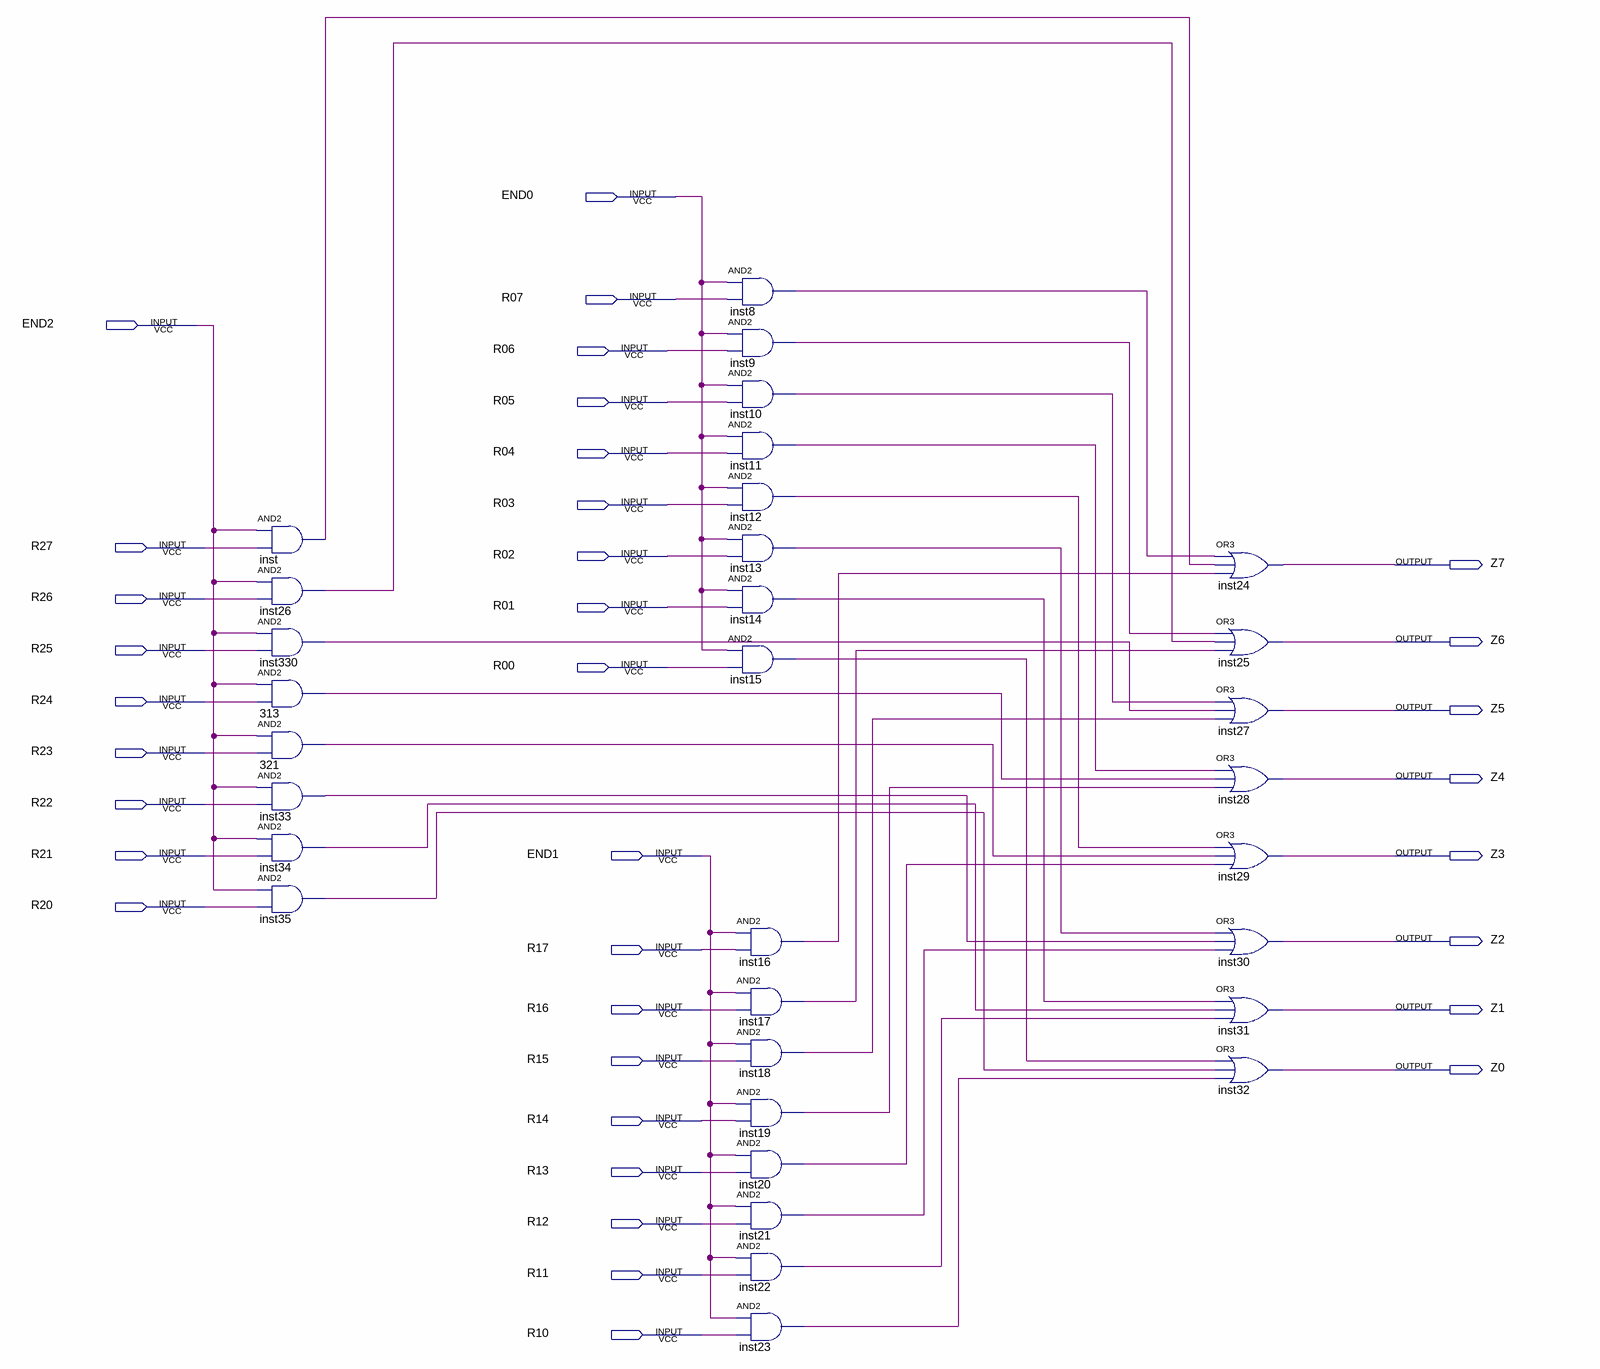
[diagram p0: schematic sheet]
// Quartus schematic select.bdf as structural Verilog: 32 symbols, 35 pins
module select (
  input  END0,
  input  R07,
  input  END2,
  input  R06,
  input  R05,
  input  R04,
  input  R03,
  input  R27,
  input  R02,
  input  R26,
  input  R01,
  input  R25,
  input  R00,
  input  R24,
  input  R23,
  input  R22,
  input  R21,
  input  END1,
  input  R20,
  input  R17,
  input  R16,
  input  R15,
  input  R14,
  input  R13,
  input  R12,
  input  R11,
  input  R10,
  output Z7,
  output Z6,
  output Z5,
  output Z4,
  output Z3,
  output Z2,
  output Z1,
  output Z0
);

  wire inst8_out, inst9_out, inst10_out, inst11_out, inst12_out, inst13_out, inst14_out, inst15_out,
       inst16_out, inst17_out, inst18_out, inst19_out, inst20_out, inst21_out, inst22_out, inst23_out,
       inst26_out, inst33_out, inst34_out, inst35_out, inst330_out, inst_out, n313_out, n321_out;

  and inst (inst_out, END2, R27);
  and inst26 (inst26_out, END2, R26);
  and inst330 (inst330_out, END2, R25);
  and u_313 (n313_out, END2, R24);
  and u_321 (n321_out, END2, R23);
  and inst33 (inst33_out, END2, R22);
  and inst34 (inst34_out, END2, R21);
  and inst35 (inst35_out, END2, R20);
  and inst8 (inst8_out, END0, R07);
  and inst9 (inst9_out, END0, R06);
  and inst10 (inst10_out, END0, R05);
  and inst11 (inst11_out, END0, R04);
  and inst12 (inst12_out, END0, R03);
  and inst13 (inst13_out, END0, R02);
  and inst14 (inst14_out, END0, R01);
  and inst15 (inst15_out, END0, R00);
  and inst16 (inst16_out, END1, R17);
  and inst17 (inst17_out, END1, R16);
  and inst18 (inst18_out, END1, R15);
  and inst19 (inst19_out, END1, R14);
  and inst20 (inst20_out, END1, R13);
  and inst21 (inst21_out, END1, R12);
  and inst22 (inst22_out, END1, R11);
  and inst23 (inst23_out, END1, R10);
  or inst24 (Z7, inst8_out, inst_out, inst16_out);
  or inst25 (Z6, inst9_out, inst26_out, inst17_out);
  or inst27 (Z5, inst10_out, inst330_out, inst18_out);
  or inst28 (Z4, inst11_out, n313_out, inst19_out);
  or inst29 (Z3, inst12_out, n321_out, inst20_out);
  or inst30 (Z2, inst13_out, inst33_out, inst21_out);
  or inst31 (Z1, inst14_out, inst34_out, inst22_out);
  or inst32 (Z0, inst15_out, inst35_out, inst23_out);
endmodule
